# Altium schematic sheet AD5679.SchDoc
size A4
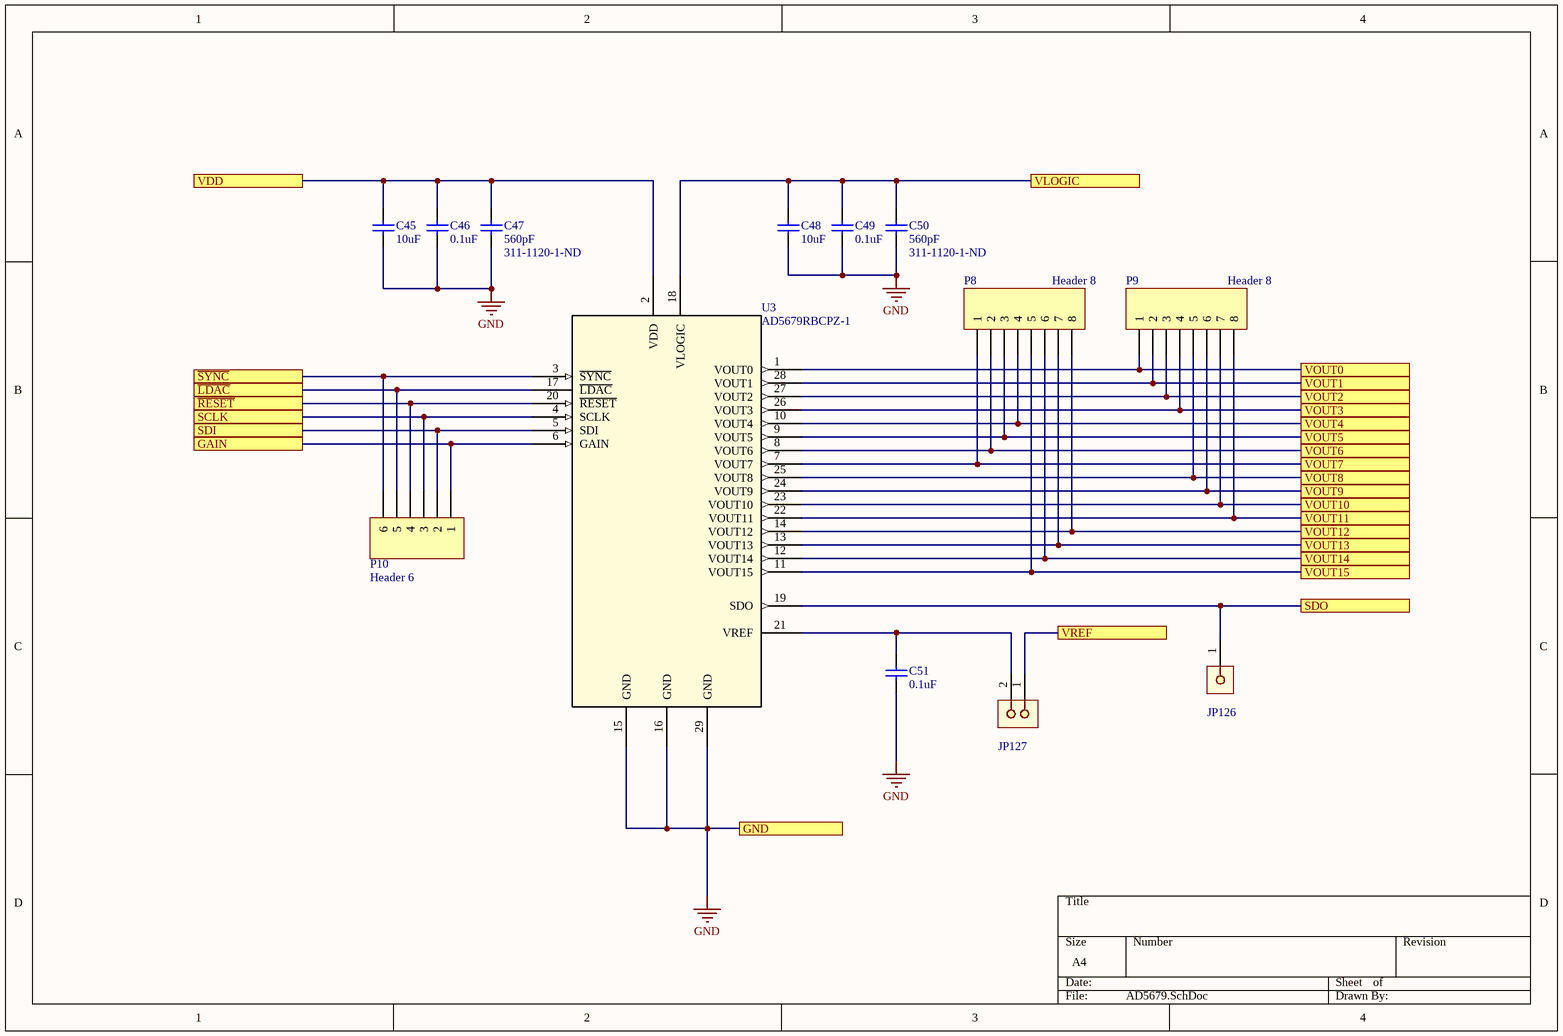
[diagram p0: AD5679.SchDoc]

## Parts
C45  10uF  [C0805]
C46  0.1uF  [C0805]
C47  560pF  Supplier Part Number 1: 311-1120-1-ND  [C0805]
C48  10uF  [C0805]
C49  0.1uF  [C0805]
C50  560pF  Supplier Part Number 1: 311-1120-1-ND  [C0805]
C51  0.1uF  [C0805]
JP126  01x01  [01x01_0_0.1in_th_straight_b_nom]  (value not drawn)
JP127  01x02  [01x02_0.1in_th_straight_b_nom]  (value not drawn)
P8  Header 8  [HDR1X8]
P9  Header 8  [HDR1X8]
P10  Header 6  [HDR1X6]
U3  AD5679RBCPZ-1  [AD5679RBCPZ-1]

## Ports
GAIN, GND, SCLK, SDI, SDO, VDD, VLOGIC, VOUT0, VOUT1, VOUT2, VOUT3, VOUT4, VOUT5, VOUT6, VOUT7, VOUT8, VOUT9, VOUT10, VOUT11, VOUT12, VOUT13, VOUT14, VOUT15, VREF, ~{LDAC}, ~{RESET}, ~{SYNC}

## Nets
GND: C45.1 C46.1 C47.1 C48.1 C49.1 C50.1 C51.1 U3.15(GND) U3.16(GND) U3.29(GND) ; port GND
GAIN: P10.1 U3.6(GAIN) ; port GAIN
~{LDAC}: P10.5 U3.17(~{LDAC}) ; port ~{LDAC}
~{RESET}: P10.4 U3.20(~{RESET}) ; port ~{RESET}
~{SYNC}: P10.6 U3.3(~{SYNC}) ; port ~{SYNC}
SCLK: P10.3 U3.4(SCLK) ; port SCLK
SDI: P10.2 U3.5(SDI) ; port SDI
SDO: JP126.1 U3.19(SDO) ; port SDO
VDD: C45.2 C46.2 C47.2 U3.2(VDD) ; port VDD
VLOGIC: C48.2 C49.2 C50.2 U3.18(VLOGIC) ; port VLOGIC
VOUT0: P9.1 U3.1(VOUT0) ; port VOUT0
VOUT1: P9.2 U3.28(VOUT1) ; port VOUT1
VOUT2: P9.3 U3.27(VOUT2) ; port VOUT2
VOUT3: P9.4 U3.26(VOUT3) ; port VOUT3
VOUT4: P8.4 U3.10(VOUT4) ; port VOUT4
VOUT5: P8.3 U3.9(VOUT5) ; port VOUT5
VOUT6: P8.2 U3.8(VOUT6) ; port VOUT6
VOUT7: P8.1 U3.7(VOUT7) ; port VOUT7
VOUT8: P9.5 U3.25(VOUT8) ; port VOUT8
VOUT9: P9.6 U3.24(VOUT9) ; port VOUT9
VOUT10: P9.7 U3.23(VOUT10) ; port VOUT10
VOUT11: P9.8 U3.22(VOUT11) ; port VOUT11
VOUT12: P8.8 U3.14(VOUT12) ; port VOUT12
VOUT13: P8.7 U3.13(VOUT13) ; port VOUT13
VOUT14: P8.6 U3.12(VOUT14) ; port VOUT14
VOUT15: P8.5 U3.11(VOUT15) ; port VOUT15
VREF: JP127.1 ; port VREF
NetC51_2: C51.2 JP127.2 U3.21(VREF)

## Library data of the parts
C45 C48 = Cap 10uF: Manufacturer: Taiyo Yuden; Manufacturer Part Number: UMK212SD103KD-T; Dielectric Material: Ceramic; Capacitance: 10nF; Tolerance: 10%; Voltage Rating: 50V; Supplier 1: Digi-Key; Stock 1: 14125; Pricing 1: 1=0.47, 10=0.323, 100=0.1941, 500=0.1455, 1000=0.1229 (USD); Mount: Surface Mount; Case/Package: 0805; Number of Pins: 2; Case Code (Metric): 2012; Case Code (Imperial): 0805; Min Operating Temperature: -55°C; Max Operating Temperature: 125°C; Packaging: Tape and Reel; Package Quantity: 1; Voltage Rating (DC): 50V; Termination: SMD/SMT; Length: 2mm; Height: 0.85mm; Width: 0.049inch; Thickness: 0.037inch; Depth: 1.25mm; Radiation Hardening: No; Lead Free: Lead Free; Halogen Free: Halogen Free; ComponentLink1URL: https://datasheet.ciiva.com/138/umk212sd103kd-t-ss-138661.pdf; ComponentLink1Description: https://datasheet.ciiva.com/138/umk212sd103kd-t-ss-138661.pdf; ComponentLink2URL: https://datasheet.ciiva.com/138/mlcc07-e-138662.pdf; ComponentLink2Description: https://datasheet.ciiva.com/138/mlcc07-e-138662.pdf; ComponentLink3URL: https://datasheet.ciiva.com/138/mlcc07-e-138663.pdf; ComponentLink3Description: https://datasheet.ciiva.com/138/mlcc07-e-138663.pdf; ComponentLink4URL: https://datasheet.ciiva.com/30140/303umk212sd103kd-t-30140925.pdf; ComponentLink4Description: https://datasheet.ciiva.com/30140/303umk212sd103kd-t-30140925.pdf; Supplier Part Number 1: 587-1114-1-ND
C46 C49 C51 = Cap 0.1uF: Manufacturer: Taiyo Yuden; Manufacturer Part Number: UMK212SD103KD-T; Dielectric Material: Ceramic; Capacitance: 10nF; Tolerance: 10%; Voltage Rating: 50V; Supplier 1: Digi-Key; Stock 1: 14125; Pricing 1: 1=0.47, 10=0.323, 100=0.1941, 500=0.1455, 1000=0.1229 (USD); Mount: Surface Mount; Case/Package: 0805; Number of Pins: 2; Case Code (Metric): 2012; Case Code (Imperial): 0805; Min Operating Temperature: -55°C; Max Operating Temperature: 125°C; Packaging: Tape and Reel; Package Quantity: 1; Voltage Rating (DC): 50V; Termination: SMD/SMT; Length: 2mm; Height: 0.85mm; Width: 0.049inch; Thickness: 0.037inch; Depth: 1.25mm; Radiation Hardening: No; Lead Free: Lead Free; Halogen Free: Halogen Free; ComponentLink1URL: https://datasheet.ciiva.com/138/umk212sd103kd-t-ss-138661.pdf; ComponentLink1Description: https://datasheet.ciiva.com/138/umk212sd103kd-t-ss-138661.pdf; ComponentLink2URL: https://datasheet.ciiva.com/138/mlcc07-e-138662.pdf; ComponentLink2Description: https://datasheet.ciiva.com/138/mlcc07-e-138662.pdf; ComponentLink3URL: https://datasheet.ciiva.com/138/mlcc07-e-138663.pdf; ComponentLink3Description: https://datasheet.ciiva.com/138/mlcc07-e-138663.pdf; ComponentLink4URL: https://datasheet.ciiva.com/30140/303umk212sd103kd-t-30140925.pdf; ComponentLink4Description: https://datasheet.ciiva.com/30140/303umk212sd103kd-t-30140925.pdf; Supplier Part Number 1: 587-1114-1-ND
C47 C50 = Cap 560pF: Manufacturer: Taiyo Yuden; Manufacturer Part Number: UMK212SD103KD-T; Dielectric Material: Ceramic; Capacitance: 10nF; Tolerance: 10%; Voltage Rating: 50V; Stock 1: 14125; Pricing 1: 1=0.47, 10=0.323, 100=0.1941, 500=0.1455, 1000=0.1229 (USD); Mount: Surface Mount; Case/Package: 0805; Number of Pins: 2; Case Code (Metric): 2012; Case Code (Imperial): 0805; Min Operating Temperature: -55°C; Max Operating Temperature: 125°C; Packaging: Tape and Reel; Package Quantity: 1; Voltage Rating (DC): 50V; Termination: SMD/SMT; Length: 2mm; Height: 0.85mm; Width: 0.049inch; Thickness: 0.037inch; Depth: 1.25mm; Radiation Hardening: No; Lead Free: Lead Free; Halogen Free: Halogen Free; ComponentLink1URL: https://datasheet.ciiva.com/138/umk212sd103kd-t-ss-138661.pdf; ComponentLink1Description: https://datasheet.ciiva.com/138/umk212sd103kd-t-ss-138661.pdf; ComponentLink2URL: https://datasheet.ciiva.com/138/mlcc07-e-138662.pdf; ComponentLink2Description: https://datasheet.ciiva.com/138/mlcc07-e-138662.pdf; ComponentLink3URL: https://datasheet.ciiva.com/138/mlcc07-e-138663.pdf; ComponentLink3Description: https://datasheet.ciiva.com/138/mlcc07-e-138663.pdf; ComponentLink4URL: https://datasheet.ciiva.com/30140/303umk212sd103kd-t-30140925.pdf; ComponentLink4Description: https://datasheet.ciiva.com/30140/303umk212sd103kd-t-30140925.pdf; Supplier 1: Digi-Key
JP126 = 01x01: 01X01 generic terminal connector
JP127 = 01x02: 01X02 generic terminal connector
P8 P9 = Header 8: Header, 8-Pin; LatestRevisionDate: 17-Jul-2002; LatestRevisionNote: Re-released for DXP Platform.; Publisher: Altium Limited
P10 = Header 6: Header, 6-Pin; LatestRevisionDate: 17-Jul-2002; LatestRevisionNote: Re-released for DXP Platform.; Publisher: Altium Limited
U3 = AD5679RBCPZ-1: No Description Available; Vendor: Analog Devices Inc; Built_By: EMA_Cory; SourceLibrary: Analog_Devices_2020-04-20; Datasheet: https://www.analog.com/media/en/technical-documentation/data-sheets/AD5674-5674R-5679-5679R.pdf; Manufacturer_Part_Number: AD5679RBCPZ-1; Copyright: Copyright (C) 2018 Accelerated Designs. All rights reserved; RefDes: RefDes; Type: DEV